# EAGLE design I2C_Messenger_r1 (EAGLE 6.3)
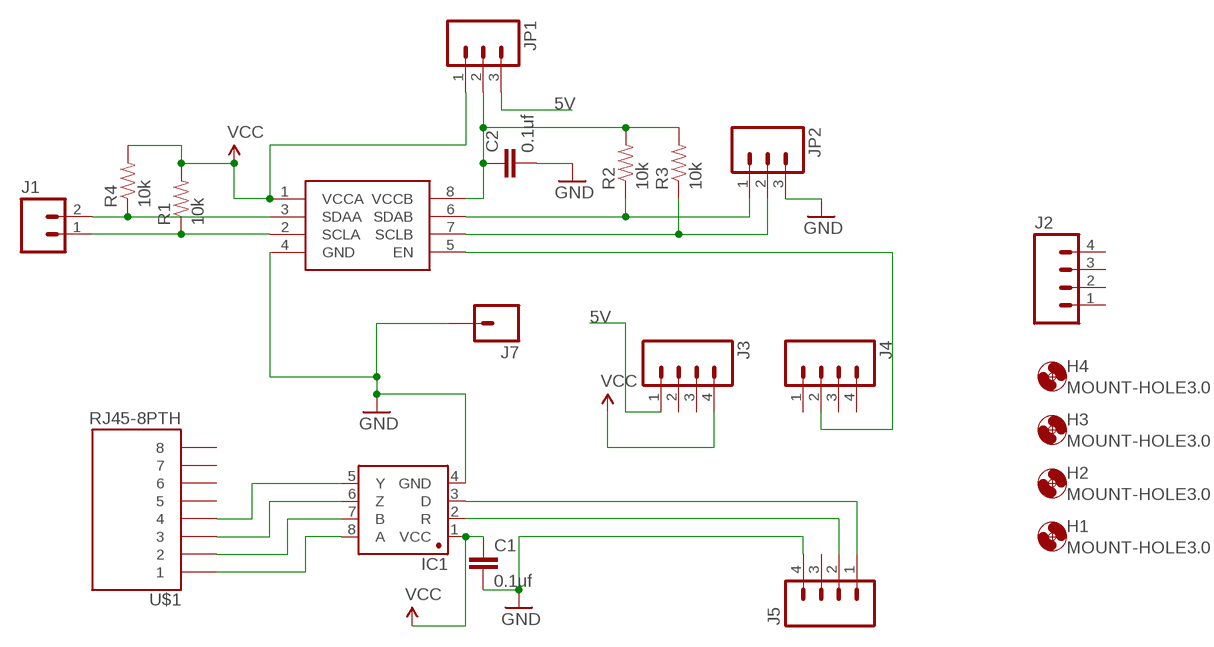
[diagram p0: schematic, sheet 1]

## Parts
C1  0.1uf  CAP1206  [1206]
C2  0.1uf  CAP1206  [1206]
H1  MOUNT-HOLE3.0  [3,0]
H2  MOUNT-HOLE3.0  [3,0]
H3  MOUNT-HOLE3.0  [3,0]
H4  MOUNT-HOLE3.0  [3,0]
IC1  SN65HVD31DR  [SO08]
IC2  PCA9517  [SO-08]
J1  M02PTH  [1X02]
J2  M04PTH  [1X04]
J3  M04PTH  [1X04]
J4  M04PTH  [1X04]
J5  M04PTH  [1X04]
J7  M01PTH  [1X01]
JP1  M03PTH  [1X03]
JP2  M03SCREW_LOCK  [SCREWTERMINAL-3.5MM-3_LOCK.007S]
R1  10k  RESISTOR1206  [1206]
R2  10k  RESISTOR1206  [1206]
R3  10k  RESISTOR1206  [1206]
R4  10k  RESISTOR1206  [1206]
U$1  RJ45-8PTH  [RJ45-8]

## Nets
5V: J3.1 JP1.3
GND: C1.2 C2.2 IC1.4(GND) IC2.4(GND) J5.4 J7.1 JP2.3
N$4: IC1.3(D) J5.1
N$5: IC2.2(SCLA) J1.1 R1.1
N$6: IC1.2(R) J5.2
N$7: IC1.8(A) U$1.1
N$8: IC1.7(B) U$1.2
N$9: IC1.6(Z) U$1.3
N$10: IC1.5(Y) U$1.4
N$11: IC2.3(SDAA) J1.2 R4.1
N$12: C2.1 IC2.8(VCCB) JP1.2 R2.2 R3.2
N$13: IC2.5(EN) J4.2
N$14: IC2.6(SDAB) JP2.1 R2.1
N$15: IC2.7(SCLB) JP2.2 R3.1
VCC: C1.1 IC1.1(VCC) IC2.1(VCCA) J3.4 JP1.1 R1.2 R4.2
Unconnected: J2.1 J2.2 J2.3 J2.4 J3.2 J3.3 J4.1 J4.3 J4.4 J5.3 U$1.5 U$1.6 U$1.7 U$1.8

## Notes on the sheet
- 5V
- 5V

## Library data of the parts
C1 C2 = SparkFun-Capacitors:CAP: Capacitor Standard 0603 ceramic capacitor, and 0.1" leaded capacitor.
H1-H4 = holes:MOUNT-HOLE: MOUNTING HOLE with drill center marker
IC1 = Joshparts4:SN65HVD31DR: A placeholder for generic narrow & wide SOIC8 foorptints - used on the DIP adapter board.
IC2 = PCA9517:PCA9517
J1 = SparkFun-Connectors:M02: Standard 2-pin 0.1" header. Use with - straight break away headers ( PRT-00116) - right angle break away headers (PRT-00553) - swiss pins (PRT-00743) - machine pins (PRT-00117) - female headers (PRT-00115) Molex polarized connector foot print use with: PRT-08233 with associated crimp pins and housings. 2.54_SCREWTERM for use with PRT-10571. 3.5mm Screw Terminal footprints for PRT-08084 5mm Screw Terminal footprints for use with PRT-08432
J2-J5 = SparkFun-Connectors:M04: Header 4 Standard 4-pin 0.1" header. Use with straight break away headers (SKU : PRT-00116), right angle break away headers (PRT-00553), swiss pins (PRT-00743), machine pins (PRT-00117), and female headers (PRT-00115). Molex polarized connector foot print use with SKU : PRT-08231 with associated crimp pins and housings. 1MM SMD Version SKU: PRT-10208; PROD_ID: CONN-09696
J7 = SparkFun-Connectors:M01: Header 1 Standard 1-pin 0.1" header. Use with straight break away headers (SKU : PRT-00116), right angle break away headers (PRT-00553), swiss pins (PRT-00743), machine pins (PRT-00117), and female headers (PRT-00115). SMTSO-256-ET is a "flush mount" nut for a 4-40 screw. The older package used to be too tight, and did not allow it to sit properly thru the drill hit. The latest (0.165DIA) fits nice and snug.
JP1 = SparkFun-Connectors:M03: Header 3 Standard 3-pin 0.1" header. Use with straight break away headers (SKU : PRT-00116), right angle break away headers (PRT-00553), swiss pins (PRT-00743), machine pins (PRT-00117), and female headers (PRT-00115). Molex polarized connector foot print use with SKU : PRT-08232 with associated crimp pins and housings.
JP2 = SparkFun-Connectors:M03: Header 3 Standard 3-pin 0.1" header. Use with straight break away headers (SKU : PRT-00116), right angle break away headers (PRT-00553), swiss pins (PRT-00743), machine pins (PRT-00117), and female headers (PRT-00115). Molex polarized connector foot print use with SKU : PRT-08232 with associated crimp pins and housings.; PROD_ID: CONN-08288
R1-R4 = SparkFun-Resistors:RESISTOR: Resistor Basic schematic elements and footprints for 0603, 1206, and PTH resistors.
U$1 = SparkFun:RJ45-8: RJ45 Jack Simple RJ45, 8-pin connection - connector for common Cat5, Cat5e, and Cat6 Ethernet cables. Footprint not yet proven in production. Connector sku is PRT-00643; Breakout PCB sku is BOB-00716.

## Board
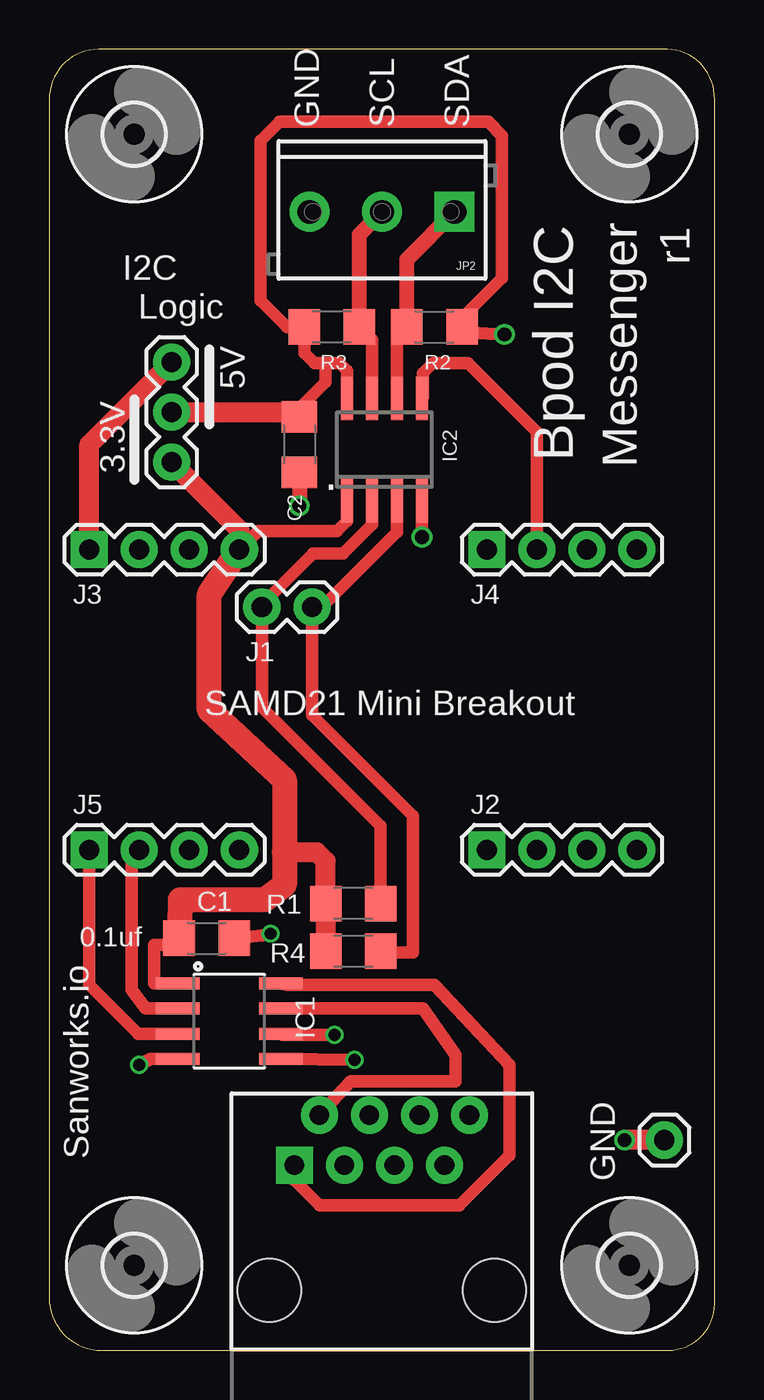
[diagram p1: board, top side]
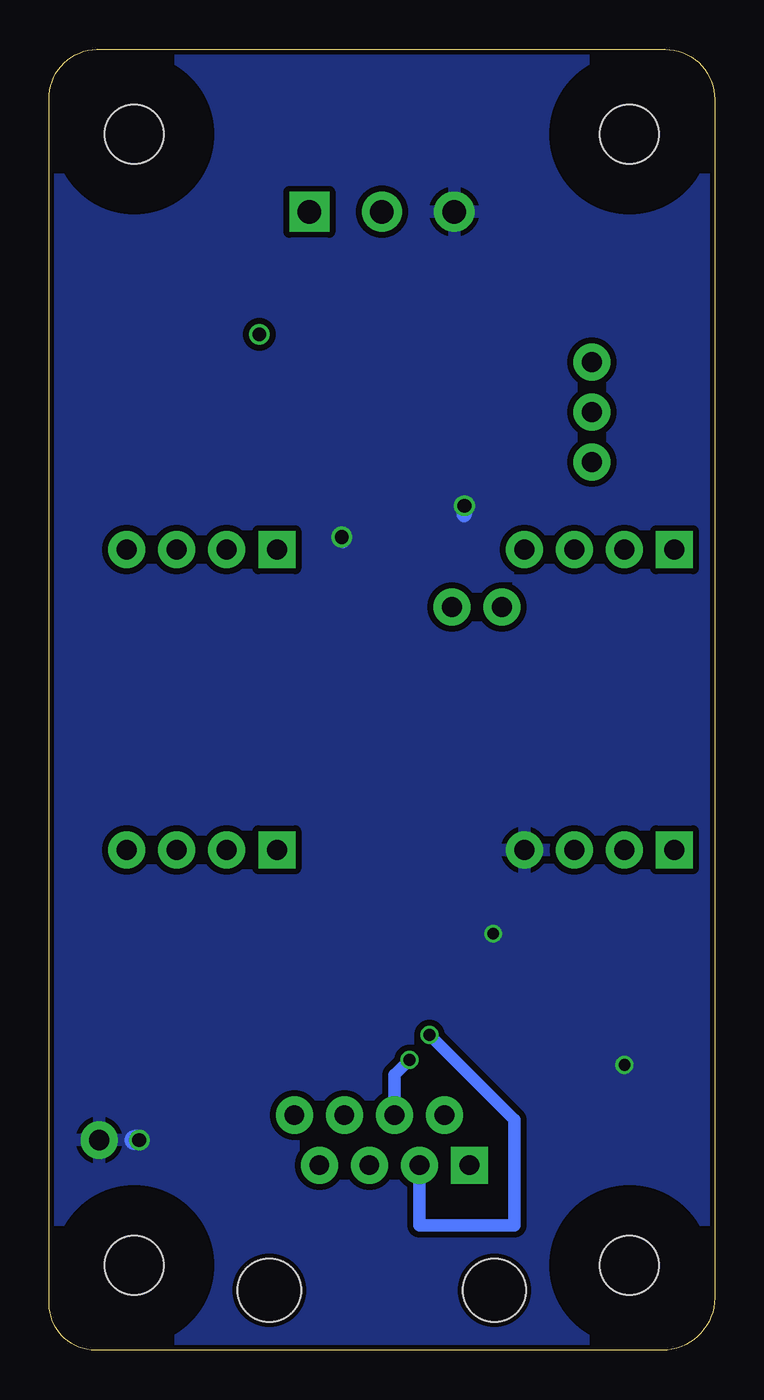
[diagram p2: board, bottom side, seen from below]

Size 33.78 x 66.04 mm. Coordinates in mm from the lower left corner, seen from the top.
Outline: 0,63.5 0,2.65 arc90 2.65,0 31.44,0 arc90 33.78,2.34 33.78,63.5 arc90 31.37,66.04 2.5,66.04 arc90 0,63.5
Copper layers (1*16): Top 0.035mm / dielectric 1.5mm / Bottom 0.035mm
Design rules "SeeedStudio_2layer_DRU_no_angle_20140221 *": minimum track width 6mil, minimum drill 12mil, track to track 12mil, track to pad 12mil, pad to pad 12mil, via to via 12mil, smd to smd 0mil, copper to edge 10mil, drill to drill 10mil, minimum pad ring 10mil, minimum via ring 6mil, stop-mask expansion 2mil, vias tented up to drill 100mil, thermal gap 10mil

### Footprints (pad centres in the part's own frame; a part is rotated, then mirrored left to right if it is on the bottom)
1206 = smd 1.6 x 1.8: 1 -1.4,0; 2 1.4,0
3,0 = hole 3: 0,0
SO08 = smd 0.61 x 2.21: 1 -1.905,-2.616; 2 -0.635,-2.616; 3 0.635,-2.616; 4 1.905,-2.616; 5 1.905,2.616; 6 0.635,2.616; 7 -0.635,2.616; 8 -1.905,2.616
SO-08 = smd 0.6 x 2.2: 1 -1.905,-2.6; 2 -0.635,-2.6; 3 0.635,-2.6; 4 1.905,-2.6; 5 1.905,2.6; 6 0.635,2.6; 7 -0.635,2.6; 8 -1.905,2.6
1X02 = drill 1.016 pad 1.88: 1 0,0; 2 2.54,0
1X04 = drill 1.016 pad 1.88 square: 1 0,0 | drill 1.016 pad 1.88: 2 2.54,0; 3 5.08,0; 4 7.62,0
1X01 = drill 1.016 pad 1.88: 1 0,0
1X03 = drill 1.016 pad 1.88: 1 0,0; 2 2.54,0; 3 5.08,0
SCREWTERMINAL-3.5MM-3_LOCK.007S = drill 1.2 pad 2.032 square: 1 -0.178,0 | drill 1.2 pad 2.032: 2 3.5,0; 3 7.178,0
RJ45-8 = drill 1 pad 1.88 square: 1 -4.445,6.35 | drill 1 pad 1.88: 2 -3.175,8.89; 3 -1.905,6.35; 4 -0.635,8.89; 5 0.635,6.35; 6 1.905,8.89; 7 3.175,6.35; 8 4.445,8.89 | hole 3.2: -5.715,0; 5.715,0

### Placement (x,y rotation side)
C1  8,20.91 0 top
C2  12.7,45.97 270 top
H1  4.32,4.32 0 top
H2  29.46,4.32 0 top
H3  29.46,61.72 0 top
H4  4.32,61.72 0 top
IC1  9.14,16.71 270 top
IC2  17.02,45.72 0 top
J1  10.79,37.72 0 top
J2  22.23,25.4 0 top
J3  2.03,40.64 0 top
J4  22.23,40.64 0 top
J5  2.03,25.4 0 top
J7  31.24,10.67 0 top
JP1  6.22,45.09 90 top
JP2  20.4,57.78 180 top
R1  15.43,22.67 180 top
R2  19.56,51.94 0 top
R3  14.35,51.94 180 top
R4  15.43,20.26 180 top
U$1  16.89,3.05 0 top

### Tracks (layer width: path | path; a pad name or v marks a point on that pad's centre or on a via)
5V
  Top 1.016: J3.1 2.03,45.97 JP1.3
GND  (via drill 0.6, 0.7)
  Top 0.635: IC1.4 5.15,14.8 v4.57,14.48 | C1.2 10.82,21.06 v11.24,21.14 | IC2.4 v18.92,41.27
  Top 0.762: C2.2 v12.7,42.86
  Top 1.016: J7.1 v29.21,10.67
  Bottom 0.635: v18.92,41.27 18.92,41.08 18.86,41.02
  Bottom 0.762: v12.7,42.86 12.7,42.42
  Bottom 1.016: v29.21,10.67 29.46,10.67
  pour Bottom: 0,0 33.78,0 34.04,65.91 0.25,65.91
N$4
  Top 0.635: IC1.3 4.5,16.07 2.03,18.54 J5.1
N$5
  Top 0.635: IC2.2 16.38,41.91 14.92,40.45 13.4,40.45 10.79,37.85 J1.1 10.79,32.64 16.83,26.6 R1.1
N$6
  Top 0.635: IC1.2 4.88,17.34 4.19,18.29 4.19,25.02 J5.2
N$7
  Top 0.635: U$1.1 12.45,8.64 13.72,7.37 20.83,7.37 23.37,9.91 23.37,14.48 19.56,18.54 12.08,18.54 IC1.8
N$8
  Top 0.635: IC1.7 18.98,17.34 20.64,14.99 20.64,13.65 15.3,13.65 U$1.2
N$9  (via drill 0.6)
  Top 0.635: v14.48,16 11.82,16 IC1.6
  Bottom 0.635: U$1.3 14.99,6.35 10.16,6.35 10.16,11.68 v14.48,16
N$10  (via drill 0.6)
  Top 0.635: v15.49,14.73 IC1.5
  Bottom 0.635: U$1.4 16.26,13.97 v15.49,14.73
N$11
  Top 0.635: J1.2 13.84,37.72 | 13.84,37.72 17.65,41.53 IC2.3 | R4.1 17.59,20.19 18.48,20.19 18.48,27.11 13.34,32.26 13.34,37.21 13.84,37.72
N$12  (via drill 0.7)
  Top 0.635: v23.11,51.56 20.96,51.69 R2.2 20.96,52.39 22.99,54.42 22.99,61.66 22.29,62.36 11.68,62.36 10.73,61.4 10.73,53.28 12.06,51.94 R3.2 12.95,50.61 13.46,50.1 14.03,50.1 | IC2.8 15.11,49.72 14.73,50.1 14.03,50.1 | C2.1 12.7,47.82 14.03,49.15 14.03,50.1
  Top 1.016: JP1.2 12.32,47.62 C2.1
N$13
  Top 0.635: J4.2 24.77,46.61 21.27,50.1 19.49,50.1 18.99,49.59 18.99,48.38 IC2.5
N$14
  Top 0.635: IC2.6 17.65,51.44 R2.1
  Top 0.762: R2.1 18.16,55.37 JP2.1
N$15
  Top 0.635: IC2.7 16.38,51.31 R3.1
  Top 0.762: R3.1 15.75,56.64 JP2.2
VCC
  Top 0.635: IC1.1 5.33,18.61 5.33,20.57 6.6,20.57 C1.1 | IC2.1 15.11,42.1 14.61,41.59 10.6,41.59 J3.4
  Top 1.016: J3.4 9.65,41.66 JP1.1 | 11.94,25.27 13.59,25.27 14.03,24.83 R1.2 R4.2
  Top 1.27: 6.66,22.86 6.65,22.62 | 6.65,22.62 C1.1 | J3.4 8.13,38.35 8.13,32.51 11.94,28.96 11.94,25.27 11.94,23.62 10.92,22.86 6.89,22.86 6.65,22.62

### Text on the board
tPlace: GND | SCL | SDA | Bpod I2C | Messenger | r1 | I2C | Logic | 5V | 3.3V | . | SAMD21 Mini Breakout | 0.1uf | Sanworks.io | GND